# EAGLE design nodeLHC (EAGLE 6.5.0)
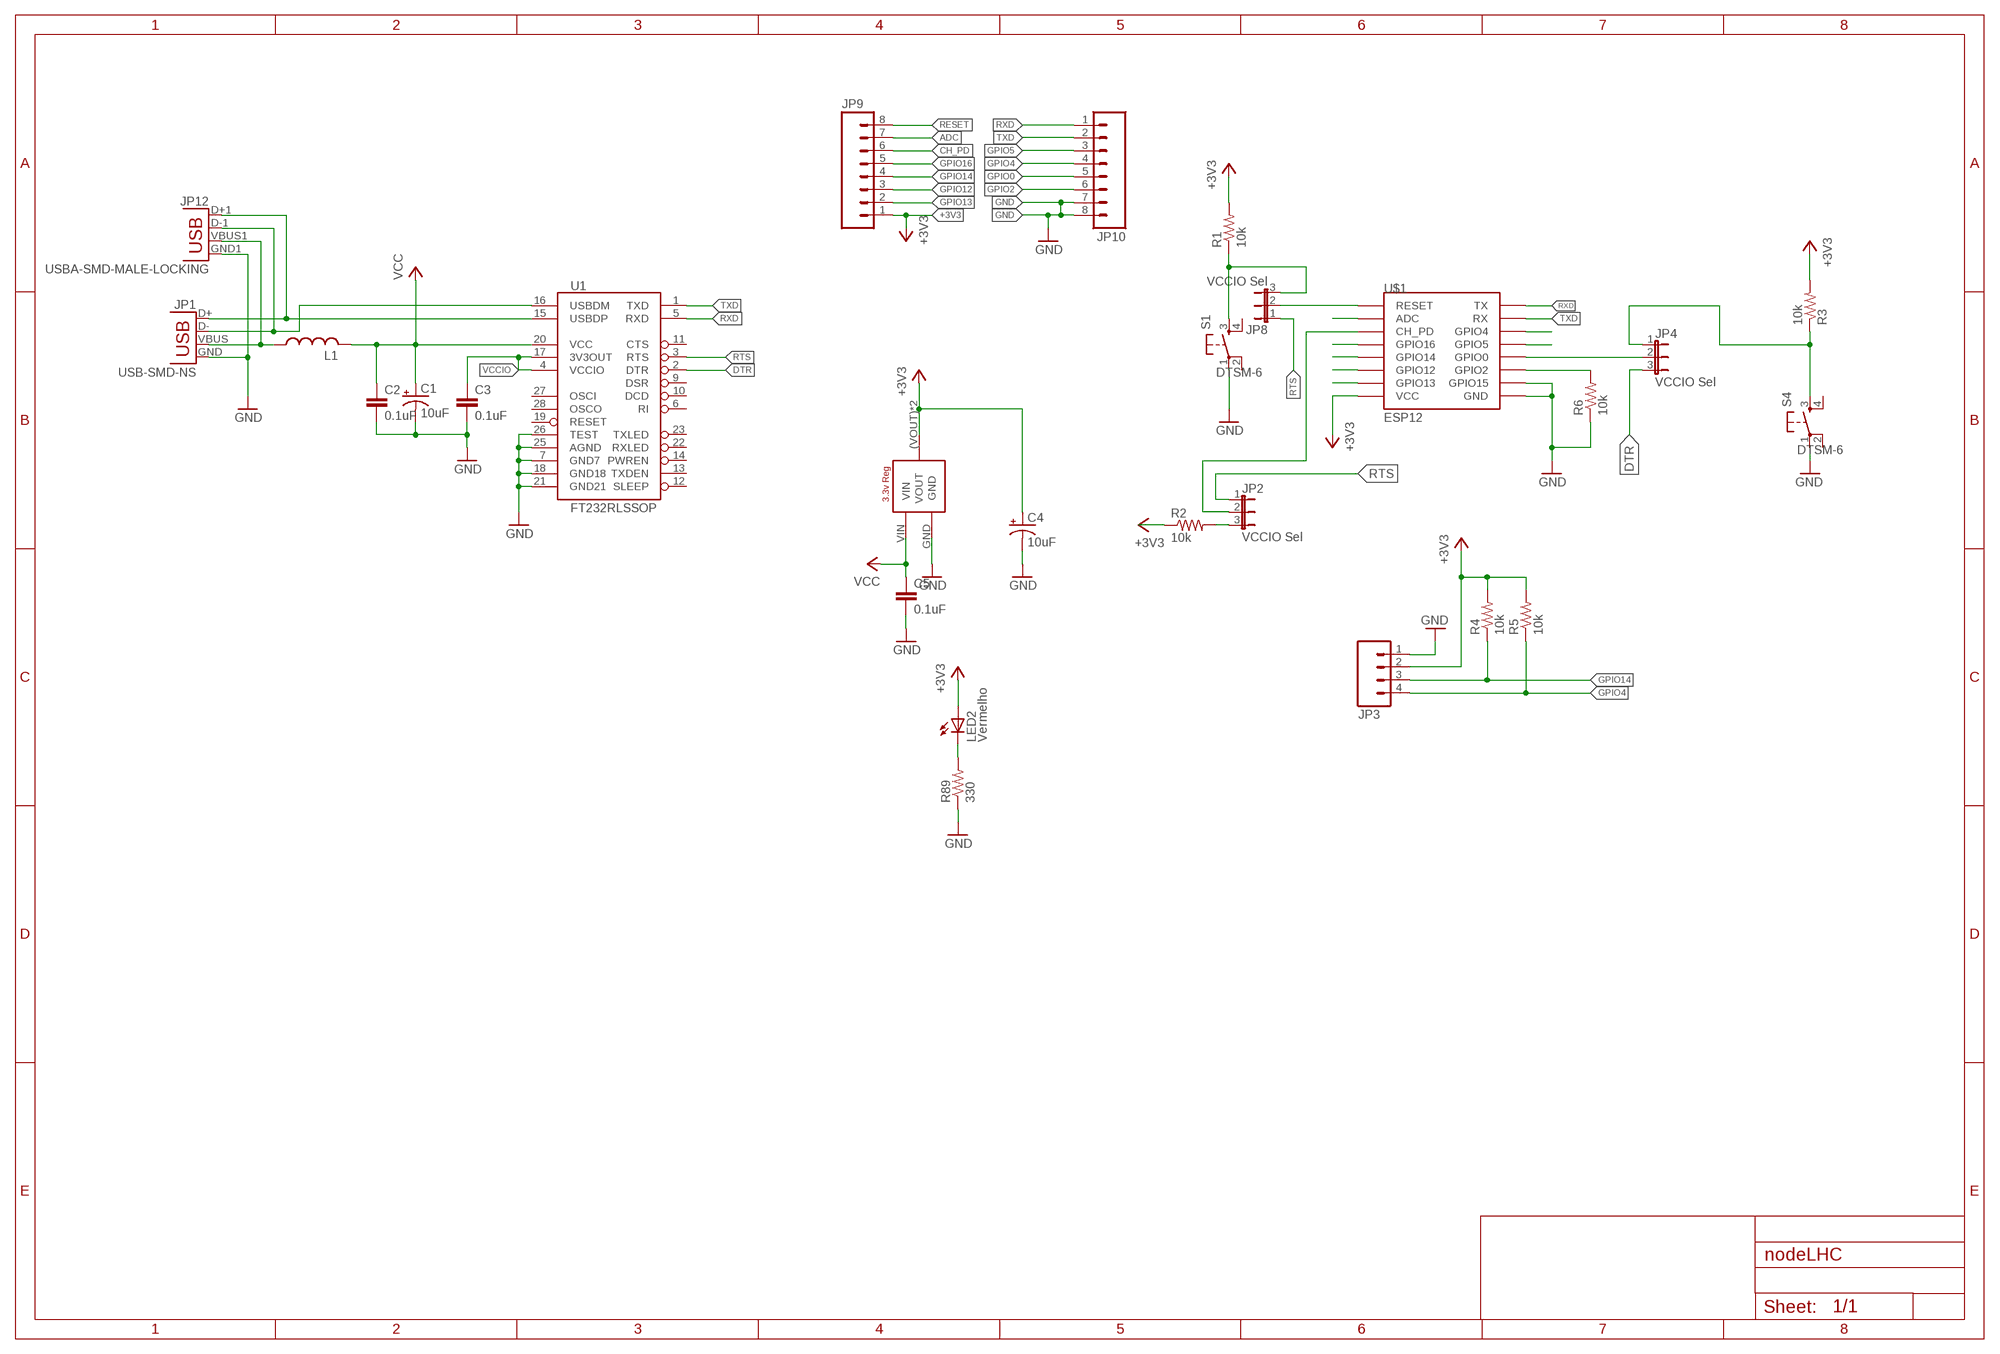
[diagram p0: schematic, sheet 1]

## Parts
C1  10uF  CPOL-US153CLV-0505  [153CLV-0505]
C2  0.1uF  C-EUC0603K  [C0603K]
C3  0.1uF  C-EUC0603K  [C0603K]
C4  10uF  CPOL-US153CLV-0505  [153CLV-0505]
C5  0.1uF  C-EUC0603K  [C0603K]
JP1  USB-SMD-NS  [USB-MINIB-NOSTOP]
JP2  VCCIO Sel  JUMPER-3SMD  [SJ_3]
JP3  M04PTH  [1X04]
JP4  VCCIO Sel  JUMPER-3SMD  [SJ_3]
JP8  VCCIO Sel  JUMPER-3SMD  [SJ_3]
JP9  M08  [1X08_ROUND]
JP10  M08  [1X08_ROUND]
JP12  USBA-SMD-MALE-LOCKING  [USB-A-SMT-MALE-LOCKING]
L1  L-US  [C0603K]
LED2  Vermelho  LEDCHIP-LED0805  [CHIP-LED0805]
R1  10k  R-US_R0603  [R0603]
R2  10k  R-US_R0603  [R0603]
R3  10k  R-US_R0603  [R0603]
R4  10k  R-US_R0603  [R0603]
R5  10k  R-US_R0603  [R0603]
R6  10k  R-US_R0603  [R0603]
R89  330  R-US_R0603  [R0603]
S1  DTSM-6  [DTSM-6]
S4  DTSM-6  [DTSM-6]
U1  FT232RLSSOP  [SSOP28DB]
U$1  ESP12  [ESP12]
U$2  LD1117  [LD1117SOT-223]

## Nets
+3V3: C4.+ JP3.2 JP9.1 LED2.A R1.2 R2.1 R3.2 R4.2 R5.2 U$1.VCC U$2.(VOUT)(VOUT) U$2.VOUT
ADC: JP9.7 U$1.ADC
CH_PD: JP2.2 JP9.6 U$1.CH_PD
DTR: JP4.3 U1.2(DTR)
GND: C1.- C2.2 C3.2 C4.- C5.2 JP1.GND JP3.1 JP10.7 JP10.8 JP12.GND1(GND) R6.1 R89.1 S1.1 S4.1 U1.7(GND7) U1.18(GND18) U1.21(GND21) U1.25(AGND) U1.26(TEST) U$1.GND U$1.GPIO15 U$2.GND
GPIO0: JP4.2 JP10.5 U$1.GPIO0
GPIO2: JP10.6 R6.2 U$1.GPIO2
GPIO4: JP3.4 JP10.4 R5.1 U$1.GPIO5
GPIO5: JP10.3 U$1.GPIO4
GPIO12: JP9.3 U$1.GPIO12
GPIO13: JP9.2 U$1.GPIO13
GPIO14: JP3.3 JP9.4 R4.1 U$1.GPIO14
GPIO16: JP9.5 U$1.GPIO16
N$3: JP2.3 R2.2
N$6: JP4.1 R3.1 S4.3
N$13: JP1.VBUS JP12.VBUS1(VBUS) L1.1
N$17: JP1.D+ JP12.D+1(D+) U1.15(USBDP)
N$18: JP1.D- JP12.D-1(D-) U1.16(USBDM)
N$30: LED2.C R89.2
RESET: JP8.2 JP9.8 U$1.RESET
RST: JP8.3 R1.1 S1.3
RTS: JP2.1 JP8.1 U1.3(RTS)
RXD: JP10.1 U1.5(RXD) U$1.TX
TXD: JP10.2 U1.1(TXD) U$1.RX
VCC: C1.+ C2.1 C5.1 L1.2 U1.20(VCC) U$2.VIN
VCCIO: C3.1 U1.4(VCCIO) U1.17(3V3OUT)
Unconnected: S1.2 S1.4 S4.2 S4.4 U1.6(RI) U1.9(DSR) U1.10(DCD) U1.11(CTS) U1.12(SLEEP) U1.13(TXDEN) U1.14(PWREN) U1.19(RESET) U1.22(RXLED) U1.23(TXLED) U1.27(OSCI) U1.28(OSCO)

## Library data of the parts
C1 C4 = rcl:CPOL-US: POLARIZED CAPACITOR, American symbol
C2 C3 C5 = rcl:C-EU: CAPACITOR, European symbol
JP1 JP12 = SparkFun-Connectors:USB: USB Connectors USB-B-PTH is fully proven SKU : PRT-00139/CONN-08278 USB-miniB is fully proven SKU : PRT-00587 USB-A-PCB is untested. USB-A-H is throughly reviewed, but untested. Spark Fun Electronics SKU : PRT-00437 USB-B-SMT is throughly reviewed, but untested. Needs silkscreen touching up. USB-A-S has not been used/tested USB-MB-H has not been used/tested USB-MICROB has been used. CONN-09505
JP2 JP4 JP8 = SparkFun:JUMPER-3
JP3 = SparkFun-Connectors:M04: Header 4 Standard 4-pin 0.1" header. Use with straight break away headers (SKU : PRT-00116), right angle break away headers (PRT-00553), swiss pins (PRT-00743), machine pins (PRT-00117), and female headers (PRT-00115). Molex polarized connector foot print use with SKU : PRT-08231 with associated crimp pins and housings. 1MM SMD Version SKU: PRT-10208
JP9 JP10 = SparkFun-Connectors:M08: Header 8 Standard 8-pin 0.1" header. Use with straight break away headers (SKU : PRT-00116), right angle break away headers (PRT-00553), swiss pins (PRT-00743), machine pins (PRT-00117), and female headers (PRT-00115).
L1 = rcl:L-US: INDUCTOR, American symbol
LED2 = led:LED: LED OSRAM: - CHIPLED LG R971, LG N971, LY N971, LG Q971, LY Q971, LO R971, LY R971 LH N974, LH R974 LS Q976, LO Q976, LY Q976 LO Q996 - Hyper CHIPLED LW Q18S LB Q993, LB Q99A, LB R99A - SideLED LS A670, LO A670, LY A670, LG A670, LP A670 LB A673, LV A673, LT A673, LW A673 LH A674 LY A675 LS A676, LA A676, LO A676, LY A676, LW A676 LS A679, LY A679, LG A679 - Hyper Micro SIDELED® LS Y876, LA Y876, LO Y876, LY Y876 LT Y87S - SmartLED LW L88C, LW L88S LB L89C, LB L89S, LG L890 LS L89K, LO L89K, LY L89K LS L896, LA L896, LO L896, LY L896 - TOPLED LS T670, LO T670, LY T670, LG T670, LP T670 LSG T670, LSP T670, LSY T670, LOP T670, LYG T670 LG T671, LOG T671, LSG T671 LB T673, LV T673, LT T673, LW T673 LH T674 LS T676, LA T676, LO T676, LY T676, LB T676, LH T676, LSB T676, LW T676 LB T67C, LV T67C, LT T67C, LS T67K, LO T67K, LY T67K, LW E67C LS E67B, LA E67B, LO E67B, LY E67B, LB E67C, LV E67C, LT E67C LW T67C LS T679, LY T679, LG T679 LS T770, LO T770, LY T770, LG T770, LP T770 LB T773, LV T773, LT T773, LW T773 LH T774 LS E675, LA E675, LY E675, LS T675 LS T776, LA T776, LO T776, LY T776, LB T776 LHGB T686 LT T68C, LB T68C - Hyper Mini TOPLED® LB M676 - Mini TOPLED Santana® LG M470 LS M47K, LO M47K, LY M47K Source: http://www.osram.convergy.de LUXEON: - LUMILED® LXK2-PW12-R00, LXK2-PW12-S00, LXK2-PW14-U00, LXK2-PW14-V00 LXK2-PM12-R00, LXK2-PM12-S00, LXK2-PM14-U00 LXK2-PE12-Q00, LXK2-PE12-R00, LXK2-PE12-S00, LXK2-PE14-T00, LXK2-PE14-U00 LXK2-PB12-K00, LXK2-PB12-L00, LXK2-PB12-M00, LXK2-PB14-N00, LXK2-PB14-P00, LXK2-PB14-Q00 LXK2-PR12-L00, LXK2-PR12-M00, LXK2-PR14-Q00, LXK2-PR14-R00 LXK2-PD12-Q00, LXK2-PD12-R00, LXK2-PD12-S00 LXK2-PH12-R00, LXK2-PH12-S00 LXK2-PL12-P00, LXK2-PL12-Q00, LXK2-PL12-R00 Source: www.luxeon.com KINGBRIGHT: KA-3528ASYC Source: www.kingbright.com
R1-R6 R89 = rcl:R-US_: RESISTOR, American symbol
S1 S4 = switch-tact:DTSM-6
U1 = SparkFun-DigitalIC:FT232RL: USB UART FT232RL 4th Generation USB UART (USB <-> Serial) Controller. Spark Fun Electronics SKU : COM-00650 Production SKU IC-00870; PROD_ID: IC-00870
U$1 = esp8266modules:ESP12: ESP8266 Wifi module 12
U$2 = LD1117:LD1117

## Board
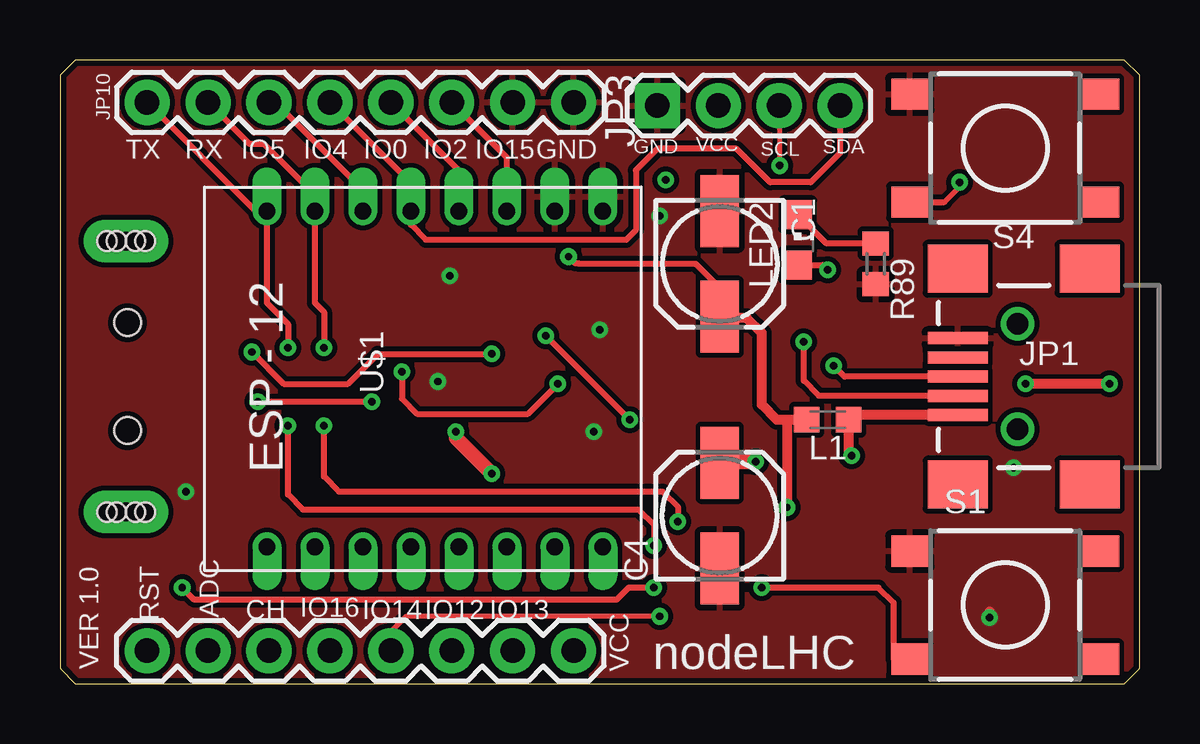
[diagram p1: board, top side]
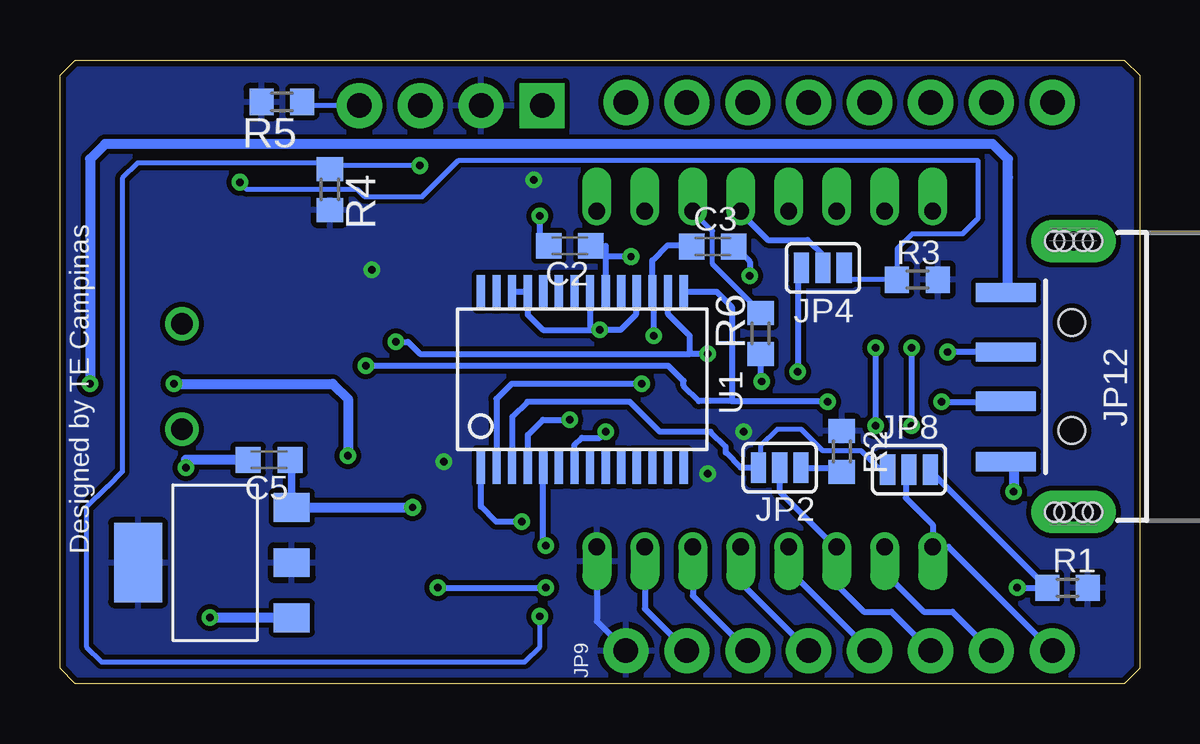
[diagram p2: board, bottom side, seen from below]

Size 45 x 26 mm. Coordinates in mm from the lower left corner, seen from the top.
Outline: 45,0.64 45,25.36 44.37,26 0.64,26 0,25.36 0,0.64 0.64,0 44.37,0 45,0.64
Copper layers (1*16): Top 0.035mm / dielectric 1.5mm / Bottom 0.035mm
Design rules "default *": minimum track width 6mil, minimum drill 8mil, track to track 8mil, track to pad 8mil, pad to pad 8mil, via to via 8mil, smd to smd 8mil, copper to edge 10mil, drill to drill 8mil, minimum pad ring 10mil, minimum via ring 8mil, stop-mask expansion 4mil, vias tented up to drill 0mil, thermal gap 10mil

### Footprints (pad centres in the part's own frame; a part is rotated, then mirrored left to right if it is on the bottom)
153CLV-0505 = smd 3 x 1.6: + 2.2,0; - -2.2,0
C0603K = smd 1.05 x 1.08: 1 -0.875,0; 2 0.875,0
USB-MINIB-NOSTOP = smd 2.5 x 0.5: D+ 2.5,0; D- 2.5,0.8; GND 2.5,-1.6; ID 2.5,-0.8; VBUS 2.5,1.6 | smd 2.5 x 2: G1 -3,-4.5; G2 -3,4.5; G3 2.5,4.5; G4 2.5,-4.5 | drill 0.9 pad 0.8: H1 0,2.2 | drill 0.9 pad 0.787: H2 0,-2.2
SJ_3 = smd 0.635 x 1.27: 1 -0.889,0; 2 0,0; 3 0.889,0
1X04 = drill 1.016 pad 1.88 square: 1 0,0 | drill 1.016 pad 1.88: 2 2.54,0; 3 5.08,0; 4 7.62,0
1X08_ROUND = drill 1.016 pad 1.88: 1 0,0; 2 2.54,0; 3 5.08,0; 4 7.62,0; 5 10.16,0; 6 12.7,0; 7 15.24,0; 8 17.78,0
USB-A-SMT-MALE-LOCKING = smd 0.8 x 2.5: D+1 1.027,-5.87; D-1 -1.027,-5.87; GND1 3.551,-5.87; VBUS1 -3.5,-5.87 | drill 0.8 pad 1.778 long: P$1 5.647,-3.05; P$3 -5.647,-3.05 | hole 1.1: 2.25,-3.12; -2.25,-3.12 | hole 0.8: -5.647,-3.45; -5.647,-3.85; -5.647,-2.65; -5.647,-2.25; 5.647,-3.45; 5.647,-3.85; 5.647,-2.65; 5.647,-2.25
CHIP-LED0805 = smd 1.2 x 1.2: A 0,-1.05; C 0,1.05
R0603 = smd 1 x 1.1: 1 -0.85,0; 2 0.85,0
DTSM-6 = smd 1.55 x 1.3: 1 -3.975,2.25; 2 3.975,2.25; 3 -3.975,-2.25; 4 3.975,-2.25
SSOP28DB = smd 0.348 x 1.397: 1 -4.225,-3.656; 2 -3.575,-3.656; 3 -2.925,-3.656; 4 -2.275,-3.656; 5 -1.625,-3.656; 6 -0.975,-3.656; 7 -0.325,-3.656; 8 0.325,-3.656; 9 0.975,-3.656; 10 1.625,-3.656; 11 2.275,-3.656; 12 2.925,-3.656; 13 3.575,-3.656; 14 4.225,-3.656; 15 4.225,3.656; 16 3.575,3.656; 17 2.925,3.656; 18 2.275,3.656; 19 1.625,3.656; 20 0.975,3.656; 21 0.325,3.656; 22 -0.325,3.656; 23 -0.975,3.656; 24 -1.625,3.656; 25 -2.275,3.656; 26 -2.925,3.656; 27 -3.575,3.656; 28 -4.225,3.656
ESP12 = drill 0.7 offset: ADC -7.1,3.8; CH_PD -7.1,1.8; GND 6.9,-8.2; GPIO0 6.9,-2.2; GPIO2 6.9,-4.2; GPIO4 6.9,1.8; GPIO5 6.9,-0.2; GPIO12 -7.1,-4.2; GPIO13 -7.1,-6.2; GPIO14 -7.1,-2.2; GPIO15 6.9,-6.2; GPIO16 -7.1,-0.2; RESET -7.1,5.8; RX 6.9,3.8; TX 6.9,5.8; VCC -7.1,-8.2
LD1117SOT-223 = smd 3.3 x 2: (VOUT) 0,3.2 | smd 1.2 x 1.5: GND -2.3,-3.2; VIN 2.3,-3.2; VOUT 0,-3.2

### Placement (x,y rotation side)
C1  27.5,17.5 270 top
C2  23.75,18.25 180 bottom
C3  17.79,18.22 0 bottom
C4  27.5,7 90 top
C5  36.28,9.33 180 bottom
JP1  39.92,12.8 180 top
JP2  15,9 0 bottom
JP3  24.9,24.1 0 top
JP4  13.2,17.33 180 bottom
JP8  9.61,8.92 0 bottom
JP9  21.41,1.37 180 top
JP10  3.63,24.23 0 top
JP12  -0.3,12.8 270 bottom
L1  32,11 180 top
LED2  30.75,18.5 0 top
R1  3,3.99 0 bottom
R2  12.41,9.68 270 bottom
R3  9.26,16.84 0 bottom
R4  33.75,20.6 270 bottom
R5  35.75,24.25 180 bottom
R6  15.8,14.6 90 bottom
R89  34,17.5 90 top
S1  39.4,3.27 0 top
S4  39.4,22.32 0 top
U1  23.23,12.68 0 bottom
U$1  14.43,12.8 90 top
U$2  38.54,5.04 90 bottom

### Tracks (layer width: path | path; a pad name or v marks a point on that pad's centre or on a via)
+3V3  (via drill 0.3)
  Top 0.254: LED2.A 31.8,17.45 v32,17.25
  Top 0.61: v29,9.25 27.55,9.25 C4.+ | v16.5,10.5 16.5,10.25 v18,8.75
  Bottom 0.254: U$1.VCC 22.62,2.58 JP9.1
  other vias: 25.25,21
  pour Bottom: 45,0.64 45,25.36 44.37,26 0.64,26 0,25.36 0,0.64 0.64,0 44.37,0
ADC
  Bottom 0.254: U$1.ADC 10.62,4.62 9,3 7.8,3 JP9.7
CH_PD
  Bottom 0.254: JP9.6 10.34,3 11.5,3 12.62,4.12 U$1.CH_PD 12.7,5.7 15,8 JP2.2
DTR  (via drill 0.3)
  Top 0.254: v14.25,13 14.25,11.88 14.88,11.25 19.5,11.25 v20.75,12.5
  Bottom 0.254: JP4.3 14.25,17.33 v14.25,13 | v20.75,12.5 26.17,12.5 26.8,11.87 U1.2
GND  (via drill 0.3)
  Top 0.406: v38.75,2.75 38.75,3
  Bottom 0.254: U1.18 21,16.34 21,15.38 21.64,14.75 v22.5,14.75 | U1.21 22.91,14.75 v22.5,14.75 | U1.26 U1.25 25.5,15.38 24.87,14.75 v22.5,14.75 | C3.2 16.89,18.22 16.25,17.59 v16.25,17 | C2.2 25,18.25 v25,19.5 | U1.7 23.55,9.95 23.25,10.25 22.5,10.25 v22.25,10.5 | R6.1 15.8,12.65 v15.75,12.6
  Bottom 0.406: U$2.GND v38.75,2.74 v38.75,2.75 | C5.2 39.75,9.33 v39.75,9 | JP12.GND1 5.25,9.25 v5.25,8
  pour Top: 45,0.64 45,25.36 44.37,26 0.64,26 0,25.36 0,0.64 0.64,0 44.37,0
GPIO0
  Top 0.254: U$1.GPIO0 16.62,21.39 JP10.5
  Bottom 0.254: U$1.GPIO0 16.62,19.62 15.5,18.5 13.84,18.5 13.2,17.86 JP4.2
GPIO2
  Top 0.254: U$1.GPIO2 18.62,21.93 JP10.6
  Bottom 0.2: 16.3,24.2 JP10.6 | R6.2 15.8,15.5 17.8,17.5 17.8,18.88 U$1.GPIO2
GPIO4
  Top 0.254: JP3.4 32.52,22.12 31.3,20.9 29.6,20.9 28.2,22.3 24.9,22.3 24,21.4 24,18.9 23.6,18.5 15.26,18.5 14.62,19.14 U$1.GPIO5 14.62,20.86 JP10.4
  Bottom 0.2: JP3.4 34.75,24.1 R5.1
GPIO5
  Top 0.254: U$1.GPIO4 12.62,20.57 9.4,23.8 9.14,23.8 JP10.3
GPIO12
  Bottom 0.254: U$1.GPIO12 18.62,3.67 JP9.3
GPIO13
  Bottom 0.254: U$1.GPIO13 20.62,3.12 JP9.2
GPIO14  (via drill 0.3)
  Top 0.2: v30,21.6 30,24.08 JP3.3 | v25,2.8 14.43,2.8 13.79,2.17 JP9.4
  Bottom 0.2: R4.1 33.7,21.8 | R4.1 33.8,21.7 41.77,21.7 42.4,21.07 42.4,8.84 43.03,8.2 43.9,7.33 43.9,1.53 43.27,0.9 25.64,0.9 25,1.53 v25,2.8 | v30,21.6 33.6,21.6 R4.1
  Bottom 0.254: U$1.GPIO14 16.62,4.21 JP9.4
GPIO16
  Bottom 0.254: U$1.GPIO16 14.62,4.75 JP9.5
N$3
  Bottom 0.254: JP2.3 12.83,9 R2.2
N$6  (via drill 0.3)
  Top 0.2: 36.87,20.07 37.5,20.71
  Top 0.254: S4.3 36.87,20.07 | 37.5,20.71 v37.5,20.9
  Bottom 0.2: 12.31,16.84 R3.1 10.11,18.11 9.47,18.75 7.38,18.75 6.75,19.39 6.75,21.82 28.39,21.82 29.91,20.3 32.3,20.3 32.6,20.6 37.2,20.6 v37.5,20.9
  Bottom 0.254: 12.31,16.84 JP4.1
N$13  (via drill 0.3)
  Top 0.406: v33,9.5 32.88,9.5 L1.1 32.88,11.2 JP1.VBUS | v43.75,12.5 v40.25,12.5
  Bottom 0.406: JP12.VBUS1 5.5,16.3 5.5,21.1 5.48,21.1 5.48,21.86 6.12,22.5 43.12,22.5 43.75,21.86 v43.75,12.5 | v40.25,12.5 33.63,12.5 33,11.87 v33,9.5
N$17  (via drill 0.3)
  Top 0.254: JP1.D+ 32.7,12.8 v32.25,13.25 | v13,11.75 v8.25,11.75
  Bottom 0.254: v32.25,13.25 19.64,13.25 19,12.62 19,12.41 18.37,11.77 17,11.77 | U1.15 17.64,16.34 17,15.7 17,11.77 | 17,11.77 13,11.77 v13,11.75 | v8.25,11.75 5.57,11.75 JP12.D+1
N$18  (via drill 0.3)
  Top 0.254: JP1.D- 31.64,12 31,12.63 v31,14.25 | v8,13.83 9.33,12.5 12,12.5 13.25,13.75 v18,13.75 18,13.83
  Bottom 0.254: v31,14.25 30.5,14.25 30,13.75 18.75,13.75 | 18.75,13.75 18.75,14.5 19.66,15.4 U1.16 | JP12.D-1 v8,13.83 | v18,13.75 18.75,13.75
N$30
  Top 0.254: 30.65,19.65 LED2.C 31.95,18.35 R89.2
RESET
  Bottom 0.254: JP8.2 9.75,8.58 9.75,7.74 8.62,6.62 U$1.RESET 7.96,5.7 JP9.8
RST  (via drill 0.3)
  Top 0.254: S1.3 34.75,1.02 34.75,3.37 34.12,4 v29.25,4 | v24.75,4 23.7,4 23.2,3.5 5.6,3.5 v5.1,4
  Bottom 0.254: JP8.3 8.72,8.86 R1.1 v5.1,4 | v29.25,4 v24.75,4
RTS
  Bottom 0.2: JP8.1 10.82,8.92 11.6,9.7 13.2,9.7 14.1,10.6 15.1,10.6 15.8,9.9 15.8,9.09 JP2.1
  Bottom 0.254: JP2.1 16.61,9 17.25,9.63 17.25,9.87 17.89,10.5 20,10.5 21.25,11.75 25.52,11.75 26.16,11.12 U1.3
RXD  (via drill 0.3)
  Top 0.254: JP10.1 8.16,19.7 U$1.TX 8.62,15.88 9.5,15 v9.5,14 | v9.5,10.75 9.5,7.88 10.13,7.25 24.11,7.25 24.75,6.62 v24.75,5.75
  Bottom 0.254: v24.75,5.75 24.86,5.75 U1.5 | v9.5,10.75 v9.5,14
TXD  (via drill 0.3)
  Top 0.254: JP10.2 7.9,22.5 8.5,22.5 10.62,20.38 U$1.RX 10.62,15.88 11,15.5 v11,14 | v11,10.75 11,8.63 11.63,8 25.11,8 25.75,7.37 v25.75,6.75
  Bottom 0.254: v25.75,6.75 26.82,6.75 27.45,7.38 U1.1 | v11,10.75 v11,14
VCC  (via drill 0.3)
  Top 0.254: C1.+ 27.5,16.5 26.5,17.5 21.64,17.5 21.64,17.52 21.48,17.52 v21.2,17.8
  Top 0.406: C1.+ 27.5,15.25 28.61,15.25 29.25,14.62 29.25,11.63 29.89,11 L1.2 30.3,11 v30.3,7.34 30.39,7.24
  Bottom 0.254: C2.1 22.25,18.25 22.25,17.8 | 22.25,17.8 U1.20 | v21.2,17.8 22.25,17.8
  Bottom 0.305: U$2.VIN 35.34,9.27 C5.1
  Bottom 0.406: U$2.VIN v30.3,7.34
VCCIO  (via drill 0.3)
  Top 0.254: v23.75,11 v20.25,14.5
  Bottom 0.254: C3.1 18.66,18.28 19.67,18.28 20.3,17.64 U1.17 20.25,16.28 v20.25,14.5 | U1.4 25.5,10.37 24.86,11 v23.75,11

### Text on the board
tPlace: TX | RX | IO5 | IO4 | IO0 | IO2 | IO15 | GND | GND | VCC | SCL | SDA | RST | ADC | CH | IO16 | IO14 | IO12 | IO13 | VER 1.0 | nodeLHC | VCC
bPlace: Designed by TE Campinas